# Altium schematic sheet ST7735.SchDoc
size A4
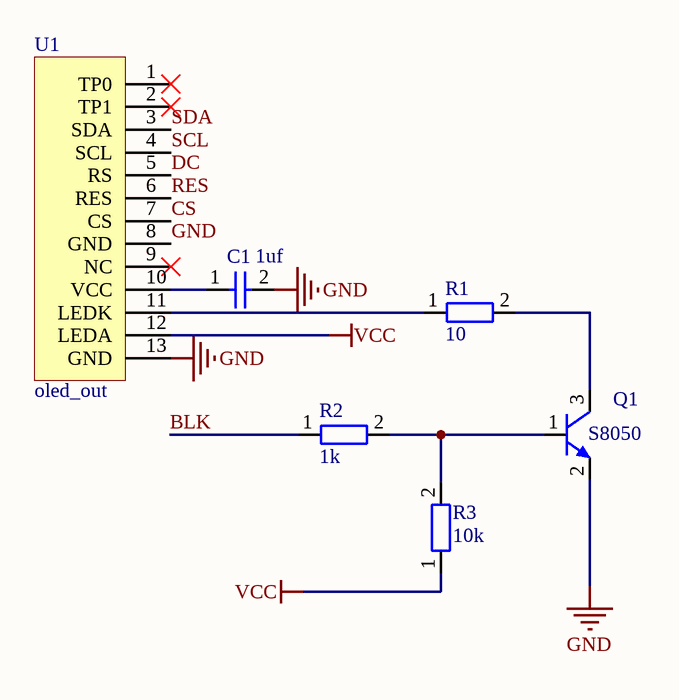
[diagram p0: ST7735.SchDoc]

## Parts
C1  1uf  [CAP]
Q1  (no value)  [S8050]
R1  10  [RES]
R2  1k  [RES]
R3  10k  [RES]
U1  oled_out  [oled_out]

## Nets
GND: C1.2 Q1.2 U1.8(GND) U1.13(GND)
VCC: R3.1 U1.12(LEDA)
BLK: R2.1
CS: U1.7(CS)
DC: U1.5(RS)
RES: U1.6(RES)
SCL: U1.4(SCL)
SDA: U1.3(SDA)
NetC1_1: C1.1 U1.10(VCC)
NetQ1_1: Q1.1 R2.2 R3.2
NetQ1_3: Q1.3 R1.2
NetR1_1: R1.1 U1.11(LEDK)

Not connected (* = marked no-connect by the designer): U1 1(TP0)* 2(TP1)* 9(NC)*

## Library data of the parts
C1 = CAP
Q1 = S8050
R1-R3 = RES